# EAGLE design AGC-Amplifier-LM13600-Stereo (EAGLE 7.2.0)
AGC Amplifier using LM13600 From: UsingOTAs2.pdf URL: http://www.idea2ic.com/LM13600/UsingOTAs2.pdf XXX
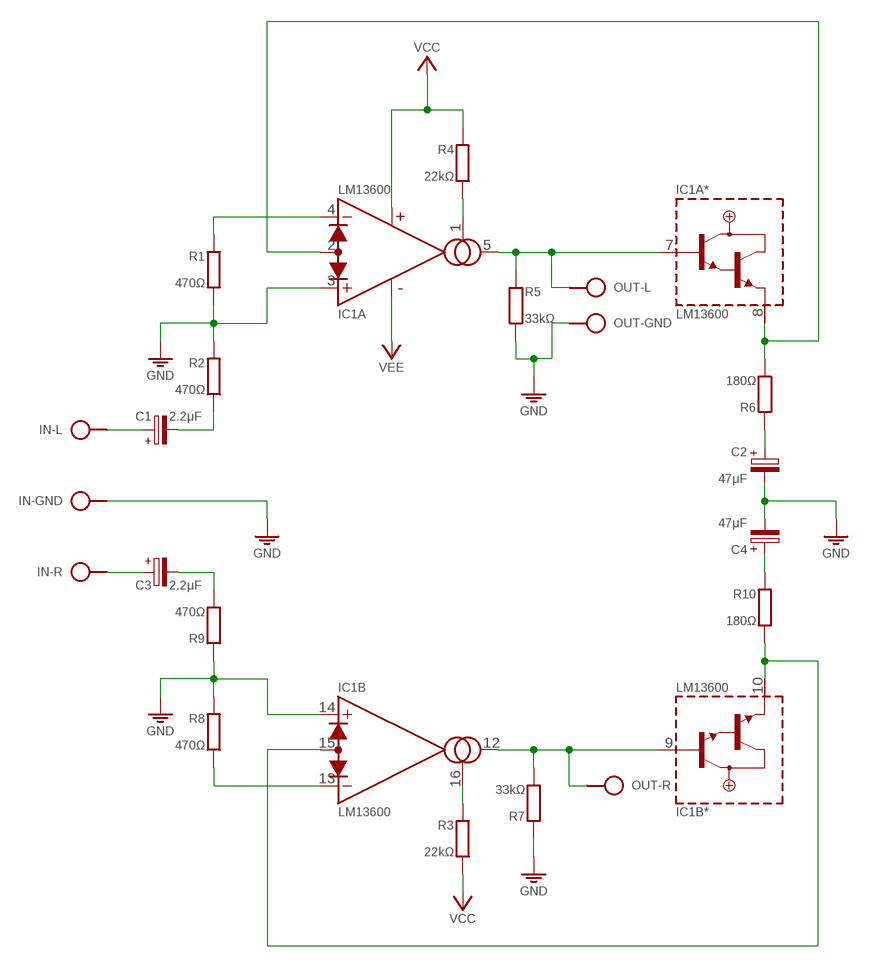
[diagram p0: schematic, sheet 1]

## Parts
C1  2.2μF  CPOL-HE2,5-4  [E2,5-4]
C2  47μF  CPOLE2,5-4/V  [E2.5-4/V]
C3  2.2μF  CPOL-HE2,5-4  [E2,5-4]
C4  47μF  CPOLE2,5-4/V  [E2.5-4/V]
IC1  LM13600  [DIL16]
IN  SAUDIOL-GND-R  [SPAD-L-GND-R]
OUT  SAUDIO  [SPAD-3]
PWR  VCC_GND_VEEPWR--GND+  [SPAD-PWR--GND+]
R1  470Ω  R0202/7-V  [0202/7-V]
R2  470Ω  R0202/7  [0202/7]
R3  22kΩ  R0202/7  [0202/7]
R4  22kΩ  R0202/7  [0202/7]
R5  33kΩ  R0202/7-V  [0202/7-V]
R6  180Ω  R0202/7-V  [0202/7-V]
R7  33kΩ  R0202/7-V  [0202/7-V]
R8  470Ω  R0202/7-V  [0202/7-V]
R9  470Ω  R0202/7-V  [0202/7-V]
R10  180Ω  R0202/7-V  [0202/7-V]

## Nets
GND: C2.- C4.- IC1.3(A:+IN) IC1.14(B:+IN) IN.0 OUT.2 PWR.GND R1.2 R2.1 R5.2 R7.1 R8.1 R9.1
N$1: IC1.1(A:AMP/BIAS) R4.2
N$2: C1.- R2.2
N$3: C2.+ R6.1
N$4: IC1.4(A:-IN) R1.1
N$5: IC1.2(A:DIODE/BIAS) IC1.8(A*:BUFF/OUT) R6.2
N$6: C1.+ IN.L
N$7: IC1.5(A:OUT) IC1.7(A*:BUFF/IN) OUT.1 R5.1
N$8: IC1.16(B:AMP/BIAS) R3.1
N$9: C3.- R9.2
N$10: IC1.13(B:-IN) R8.2
N$11: IC1.10(B*:BUFF/OUT) IC1.15(B:DIODE/BIAS) R10.2
N$12: C4.+ R10.1
N$13: IC1.9(B*:BUFF/IN) IC1.12(B:OUT) OUT.3 R7.2
N$14: C3.+ IN.R
VCC: IC1.11(5:V+) PWR.VCC R3.2 R4.1
VEE: IC1.6(5:V-) PWR.VEE

## Library data of the parts
C1 C3 = c:CPOL-H
C2 C4 = c:CPOL: POLARIZED CAPACITOR, European symbol
IC1 = ic:LM13600
IN OUT = pad:SAUDIO
PWR = pad:VCC_GND_VEE
R1-R10 = r:R: RESISTOR, European symbol

## Net classes
0 default: width 0.61 mm

## Board
AGC Amplifier using LM13600 From: UsingOTAs2.pdf
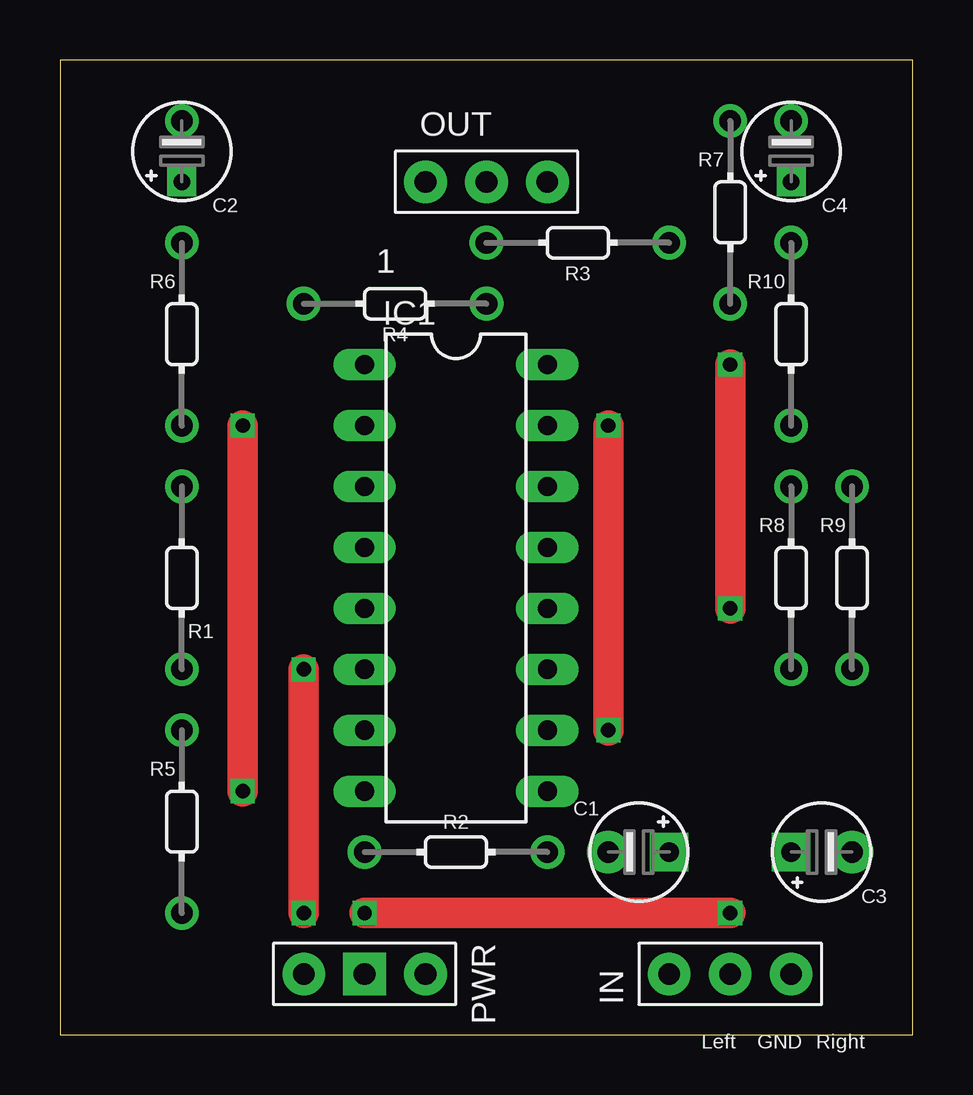
[diagram p1: board, top side]
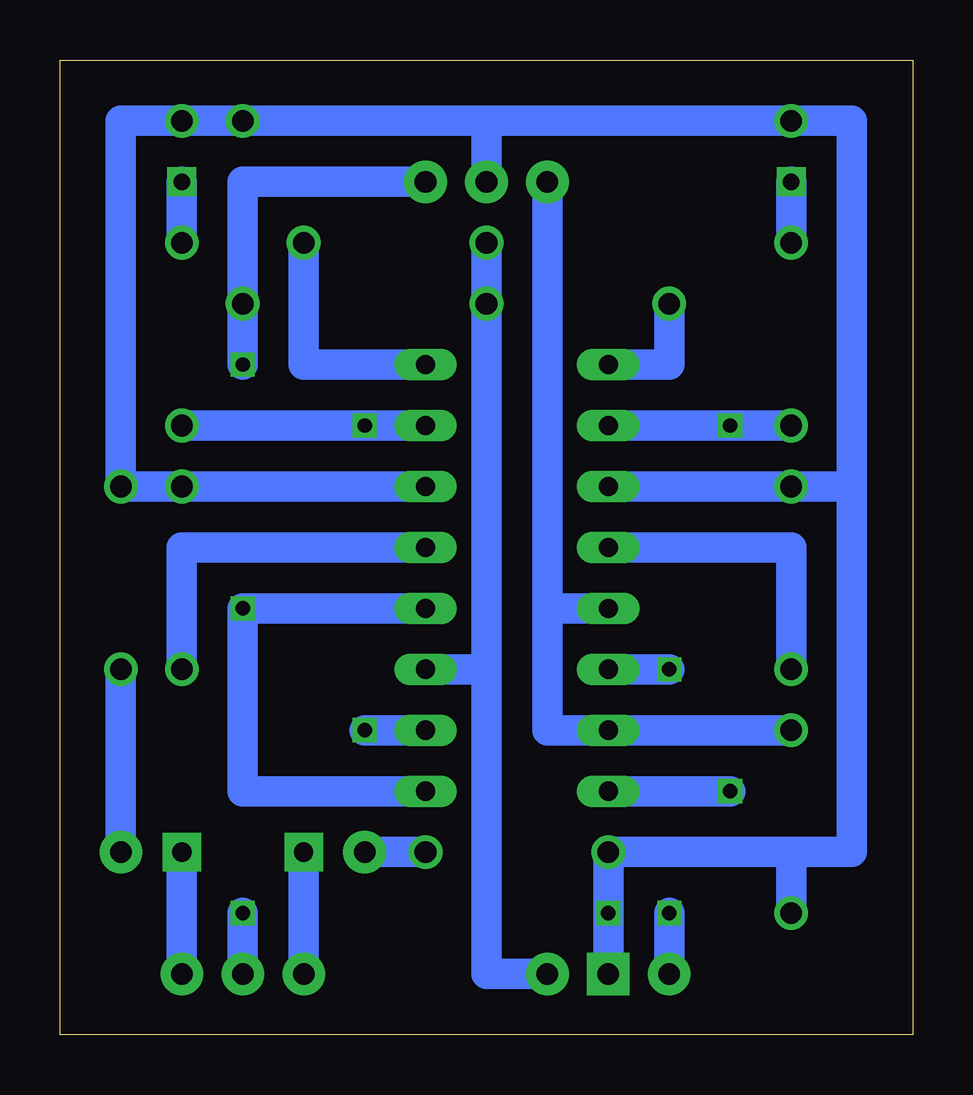
[diagram p2: board, bottom side, seen from below]

Size 35.56 x 40.64 mm. Coordinates in mm from the lower left corner, seen from the top.
Outline: 35.56,0 35.56,40.64 0,40.64 0,0 35.56,0
Copper layers (1*16): Top 0.035mm / dielectric 1.5mm / Bottom 0.035mm
Design rules "default": minimum track width 10mil, minimum drill 24mil, track to track 8mil, track to pad 8mil, pad to pad 8mil, via to via 8mil, smd to smd 8mil, copper to edge 40mil, drill to drill 8mil, minimum pad ring 10mil, minimum via ring 8mil, stop-mask expansion 4mil, vias tented up to drill 0mil, thermal gap 10mil

### Footprints (pad centres in the part's own frame; a part is rotated, then mirrored left to right if it is on the bottom)
E2,5-4 = drill 0.8 pad 1.6 square: + 1.27,0 | drill 0.9 pad 1.778: - -1.27,0
E2.5-4/V = drill 0.7 square: + 0,1.27 | drill 0.9: - 0,-1.27
DIL16 = drill 0.8 long: 1 -3.81,8.89; 2 -3.81,6.35; 3 -3.81,3.81; 4 -3.81,1.27; 5 -3.81,-1.27; 6 -3.81,-3.81; 7 -3.81,-6.35; 8 -3.81,-8.89; 9 3.81,-8.89; 10 3.81,-6.35; 11 3.81,-3.81; 12 3.81,-1.27; 13 3.81,1.27; 14 3.81,3.81; 15 3.81,6.35; 16 3.81,8.89
SPAD-L-GND-R = drill 0.9 pad 1.778: 0 0,0; L 0,2.54; R 0,-2.54
SPAD-3 = drill 0.9 pad 1.778: 1 0,-2.54; 2 0,0; 3 0,2.54
SPAD-PWR--GND+ = drill 0.9 pad 1.778 square: GND 0,0 | drill 0.9 pad 1.778: VCC 0,2.54; VEE 0,-2.54
0202/7-V = drill 0.9: 1 0,3.81; 2 0,-3.81
0202/7 = drill 0.9: 1 -3.81,0; 2 3.81,0

### Placement (x,y rotation side)
C1  24.13,7.62 0 top
C2  5.08,36.83 180 top
C3  31.75,7.62 180 top
C4  30.48,36.83 180 top
IC1  16.51,19.05 0 top
IN  27.94,2.54 90 top
OUT  17.78,35.56 270 top
PWR  12.7,2.54 270 top
R1  5.08,19.05 180 top
R2  16.51,7.62 0 top
R3  21.59,33.02 180 top
R4  13.97,30.48 180 top
R5  5.08,8.89 0 top
R6  5.08,29.21 0 top
R7  27.94,34.29 0 top
R8  30.48,19.05 0 top
R9  33.02,19.05 0 top
R10  30.48,29.21 0 top

### Tracks (layer width: path | path; a pad name or v marks a point on that pad's centre or on a via)
GND  (via drill 0.6)
  Top 1.27: v27.94,5.08 v12.7,5.08
  Bottom 1.27: IC1.3 R1.2 2.54,22.86 | 2.54,22.86 2.54,38.1 C2.- 17.78,38.1 | IN.0 v27.94,5.08 | PWR.GND v12.7,5.08 R2.1 5.08,7.62 | 17.78,38.1 OUT.2 | 2.54,22.86 2.54,7.62 5.08,7.62 | 5.08,7.62 R5.2 | 17.78,38.1 R7.1 C4.- 33.02,38.1 R9.1 R8.1 IC1.14
N$1
  Bottom 1.27: IC1.1 10.16,27.94 R4.2
N$2
  Bottom 1.27: C1.- R2.2
N$3
  Bottom 1.27: R6.1 C2.+
N$4
  Bottom 1.27: R1.1 5.08,20.32 IC1.4
N$5  (via drill 0.6)
  Top 1.27: v7.62,10.16 v7.62,25.4
  Bottom 1.27: IC1.8 v7.62,10.16 | IC1.2 v7.62,25.4 R6.2
N$6
  Bottom 1.27: C1.+ IN.L
N$7
  Bottom 1.27: 15.24,17.78 OUT.1 | IC1.5 15.24,17.78 | 15.24,17.78 15.24,12.7 IC1.7 R5.1
N$8
  Bottom 1.27: IC1.16 25.4,27.94 R3.1
N$9
  Bottom 1.27: R9.2 C3.-
N$10
  Bottom 1.27: IC1.13 30.48,20.32 R8.2
N$11  (via drill 0.6)
  Top 1.27: v22.86,12.7 v22.86,25.4
  Bottom 1.27: IC1.15 v22.86,25.4 R10.2 | IC1.10 v22.86,12.7
N$12
  Bottom 1.27: C4.+ R10.1
N$13  (via drill 0.6)
  Top 1.27: v27.94,17.78 v27.94,27.94
  Bottom 1.27: IC1.12 v27.94,17.78 27.94,10.16 IC1.9 | OUT.3 27.94,35.56 R7.2 v27.94,27.94
N$14
  Bottom 1.27: C3.+ IN.R
VCC
  Bottom 1.27: 17.78,15.24 R3.2 R4.1 | IC1.11 17.78,15.24 | 17.78,15.24 17.78,2.54 PWR.VCC
VEE  (via drill 0.6)
  Top 1.27: v10.16,5.08 v10.16,15.24
  Bottom 1.27: PWR.VEE v10.16,5.08 | v10.16,15.24 IC1.6

### Text on the board
Measures: 15 | 14 | 13 | 12 | 11 | 10 | 9 | 8 | 7 | 6 | 5 | 4 | 3 | 2 | 1 | 1 | 2 | 3 | 4 | 5 | 6 | 7 | 8 | 9 | 10 | 11 | 12 | 13